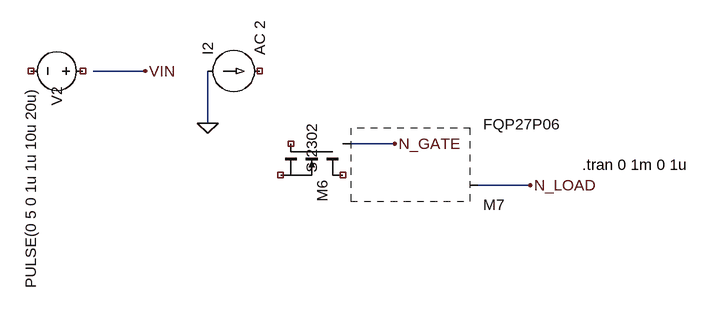
[diagram p0: schematic case_15.asc]
case_15.asc, the LTspice schematic file:
Version 4.1
SHEET 1 880 680
WIRE 144 96 224 96
WIRE 320 96 320 176
WIRE 528 208 608 208
WIRE 736 272 816 272
FLAG 224 96 VIN
FLAG 320 176 0
FLAG 608 208 N_GATE
FLAG 816 272 N_LOAD
SYMBOL voltage 144 96 R90
WINDOW 0 24 56 Left 2
SYMATTR InstName V2
SYMATTR Value PULSE(0 5 0 1u 1u 10u 20u)
SYMATTR SpiceLine Rser=0.001
SYMBOL Sources\current 320 96 R270
SYMATTR InstName I2
SYMATTR Value AC 2
SYMATTR Type source
SYMBOL nmos 528 208 R90
WINDOW 3 -32 48 Left 2
SYMATTR InstName M6
SYMATTR Value SI2302
SYMATTR Type nmos
SYMBOL Power\pmos 736 272 M180
SYMATTR InstName M7
SYMATTR Value FQP27P06
SYMATTR SpiceLine m=6
TEXT 896 240 Left 2 !.tran 0 1m 0 1u

The netlist it stands for:
* case_15.asc
V2 NC_01 NC_02 PULSE(0 5 0 1u 1u 10u 20u) Rser=0.001
I2 0 NC_03 AC 2
M6 NC_04 NC_05 NC_06 NC_06 SI2302
* M7: FQP27P06 m=6 (symbol Power\pmos not available, pin order unknown); nets seen at it: N_GATE, N_LOAD
.model NMOS NMOS
.model PMOS PMOS
.lib standard.mos
.tran 0 1m 0 1u
.backanno
.end